# Altium project Smoke_Detector.PrjPcb (part 2 of 4)
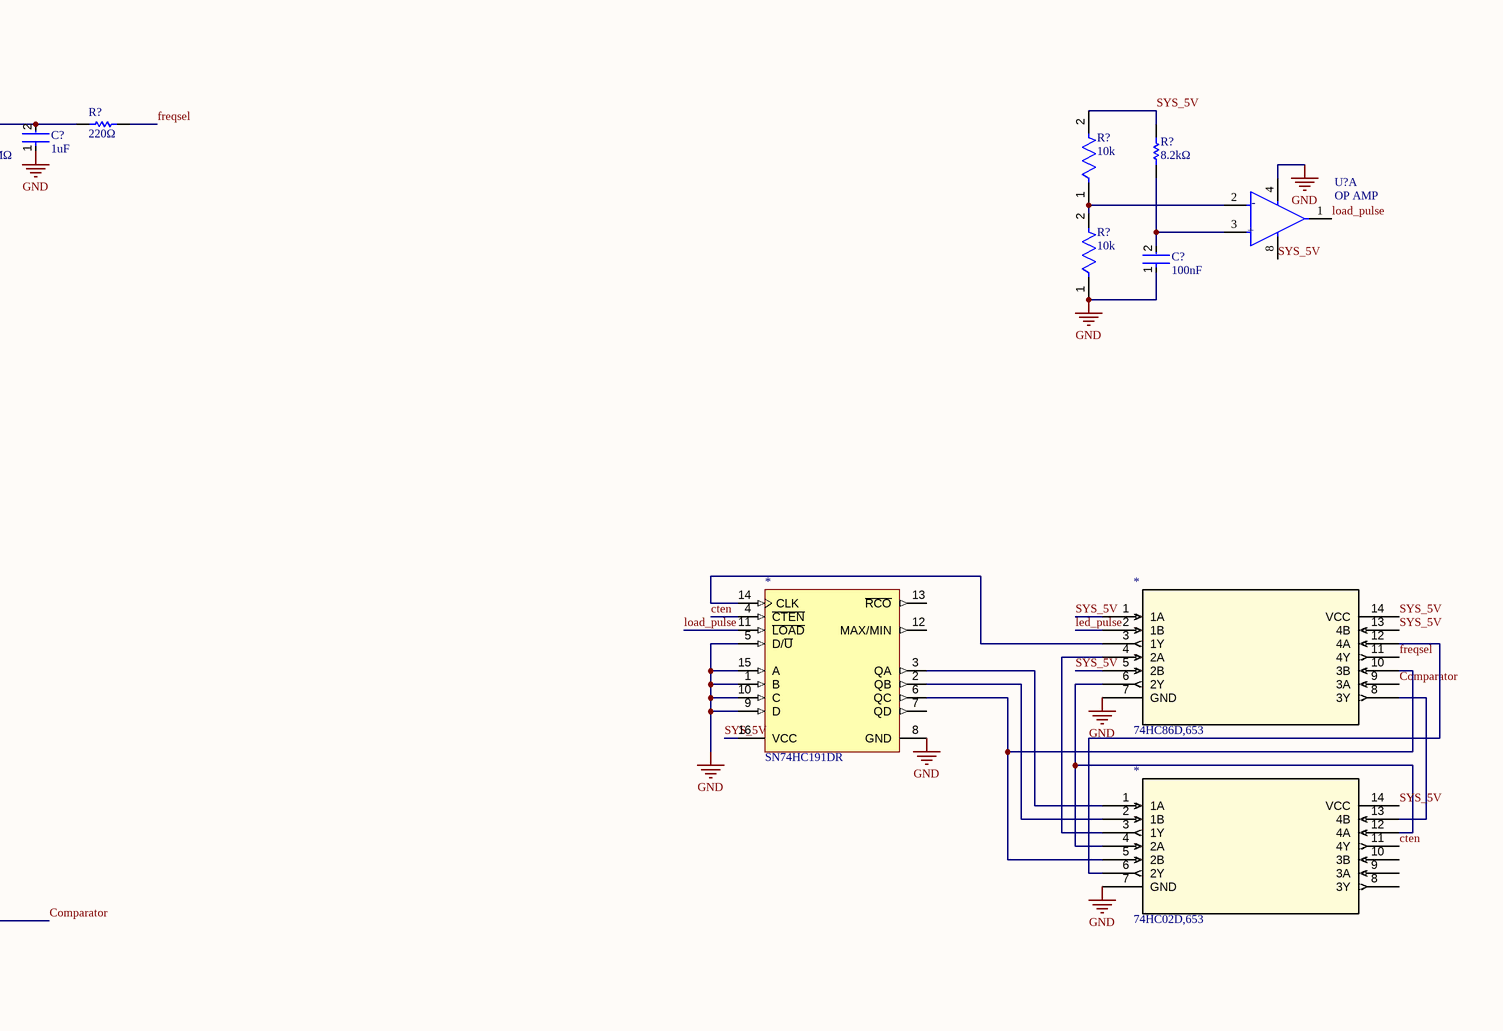
[diagram p2: Sheet1.SchDoc, right]

## Sheet Sheet1.SchDoc (continued)
### Library data of the parts
*#1 *#3 *#4 *#10 *#11 = AO3400A: MOSFET N-CH 30V 5.8A SOT-23; Manufacturer: Alpha & Omega Semiconductor; Continuous Drain Current (ID): 5.7A; Drain to Source Resistance: 26.5mΩ; Gate to Source Voltage (Vgs): 12V; Input Capacitance: 630pF; Max Junction Temperature (Tj): 150°C; Max Power Dissipation: 1.4W; Number of Channels: 1; Threshold Voltage: 650mV; Turn-Off Delay Time: 25ns; Turn-On Delay Time: 3ns; Supplier: DigiKey; Supplier Part Number: 785-1000-6-ND; Manufacturer Part Number: AO3400A; RoHS: Compliant; Category: MOSFETs; Stock: 336146; Pricing: 1=0.52, 10=0.322, 50=0.2332, 100=0.2043, 500=0.15316 (USD); Case/Package: SOT-23; Country of Origin: Mainland China; Drain to Source Breakdown Voltage: 30V; Drain to Source Voltage (Vdss): 30V; Export Control Classification Number (ECCN) Code: EAR99; Height: 1.25mm; Introduction Date: 2007-04-17; Lead Free: Lead Free; Lifecycle Status: Production; Max Operating Temperature: 150°C; Min Breakdown Voltage: 30V; Min Operating Temperature: -55°C; Mounting Technology: Surface Mount; Number of Elements: 1; Pins: 3; Number of Terminals: 3; Power Dissipation: 1.4W; Radiation Hardening: No; Rds On Max: 26.5mΩ; REACH SVHC: Unaffected; Schedule B: 8541290080, 8541290080|8541290080|8541290080|8541290080|8541290080; ComponentLink1URL: https://sigma.octopart.com:443/140150677/technical_drawing/Alpha-%26-Omega-Semiconductor-AO3400A.pdf?src-supplier=Alpha+%26+Omega+Semiconductor+SCT; ComponentLink1Description: https://sigma.octopart.com:443/140150677/technical_drawing/Alpha-%26-Omega-Semiconductor-AO3400A.pdf?src-supplier=Alpha+%26+Omega+Semiconductor+SCT; ComponentLink2URL: https://datasheet.octopart.com:443/AO3400A-Alpha-%26-Omega-Semiconductor-datasheet-11777925.pdf?src-supplier=IHS; ComponentLink2Description: https://datasheet.octopart.com:443/AO3400A-Alpha-%26-Omega-Semiconductor-datasheet-11777925.pdf?src-supplier=IHS; ComponentLink3URL: https://sigma.octopart.com:443/138895710/technical_drawing/Alpha-%26-Omega-Semiconductor-AO3400A.pdf?src-supplier=Upverter; ComponentLink3Description: https://sigma.octopart.com:443/138895710/technical_drawing/Alpha-%26-Omega-Semiconductor-AO3400A.pdf?src-supplier=Upverter; ComponentLink4URL: https://datasheet.octopart.com:443/AO3400A-Alpha-%26-Omega-Semiconductor-datasheet-14060799.pdf?src-supplier=iiiC; ComponentLink4Description: https://datasheet.octopart.com:443/AO3400A-Alpha-%26-Omega-Semiconductor-datasheet-14060799.pdf?src-supplier=iiiC; ComponentLink5URL: https://datasheet.octopart.com:443/AO3400A-Alpha-%26-Omega-Semiconductor-datasheet-5402508.pdf?src-supplier=Verical; ComponentLink5Description: https://datasheet.octopart.com:443/AO3400A-Alpha-%26-Omega-Semiconductor-datasheet-5402508.pdf?src-supplier=Verical
*#2 = TLC556IDR: 15V Dual LinCMOS timer 14-SOIC -40 to 85; Manufacturer: Texas Instruments; Manufacturer Lifecycle Status: ACTIVE; Frequency: 2.1MHz; High Level Output Current: -10mA; Low Level Output Current: 100mA; Max Power Dissipation: 950mW; Max Supply Voltage: 18V; Min Supply Voltage: 3V; Nominal Supply Current: 130µA; Number of Timers/Counters: 2; Operating Supply Current: 720µA; Supplier: Arrow Electronics; Supplier Part Number: TLC556IDR; Manufacturer Part Number: TLC556IDR; RoHS: Compliant; Category: Timers and Oscillators; Stock: 973; Pricing: 1=1.3938, 10=1.0552, 25=0.9641, 100=0.8647, 250=0.8042, 500=0.7847 (USD); Case/Package: SOIC; Contact Plating: Gold; Height: 0m; Lead Free: Lead Free; Length: 8.65mm; Lifecycle Status: Production; Max Operating Temperature: 85°C; Min Operating Temperature: -40°C; Mounting Technology: Surface Mount; Pins: 14; Power Dissipation: 950mW; Quiescent Current: 130µA; Radiation Hardening: No; Schedule B: 8542390000, 8542390000|8542390000, 8542390000|8542390000|8542390000, 8542390000|8542390000|8542390000|8542390000; Thickness: 1.58mm; Weight: 122.413241mg; Width: 3.91mm; ComponentLink1URL: https://sigma.octopart.com:443/182471030/technical_drawing/Texas-Instruments-TLC556IDR.pdf?src-supplier=Texas+Instruments; ComponentLink1Description: https://sigma.octopart.com:443/182471030/technical_drawing/Texas-Instruments-TLC556IDR.pdf?src-supplier=Texas+Instruments; ComponentLink2URL: https://octopart.com:443/opatz8j6/c1?t=wVb5vgt0zPQWKkF67eX7szHFu9eke679Os8KuuvsewqxubaA68h0RbxCTMV96P98jOA947BI5otjYLTO8NlJcm-sT0EwftDyiu21Zrbb2619OTaKXxEY5gqfTVo9yQc5eHmsnO_NjjO9pry39XW7zVwp5JZvYUuFi7CEvLfZBwXUvv5oJGvho0j5oLGTrHUekUSs9TZpc4u8Hs0dZvilMkIXoCg4ZsBkHlIICA4YDxdwRjADArPrk9usKJbDjqGpujKb6DUgPPp-5b6DXLWwp_NVSyXgaG7FrrCxwcsuC9e6EGdk3LvSbo4Poq0m1Apd1KwtZX406OXT8Kt7TXRfkPYmF30X_4theIHGy8QB6ScxhVB1SWES0wyhplT5iwiCIeo&src-supplier=Texas+Instruments; ComponentLink2Description: https://octopart.com:443/opatz8j6/c1?t=wVb5vgt0zPQWKkF67eX7szHFu9eke679Os8KuuvsewqxubaA68h0RbxCTMV96P98jOA947BI5otjYLTO8NlJcm-sT0EwftDyiu21Zrbb2619OTaKXxEY5gqfTVo9yQc5eHmsnO_NjjO9pry39XW7zVwp5JZvYUuFi7CEvLfZBwXUvv5oJGvho0j5oLGTrHUekUSs9TZpc4u8Hs0dZvilMkIXoCg4ZsBkHlIICA4YDxdwRjADArPrk9usKJbDjqGpujKb6DUgPPp-5b6DXLWwp_NVSyXgaG7FrrCxwcsuC9e6EGdk3LvSbo4Poq0m1Apd1KwtZX406OXT8Kt7TXRfkPYmF30X_4theIHGy8QB6ScxhVB1SWES0wyhplT5iwiCIeo&src-supplier=Texas+Instruments; ComponentLink3URL: https://datasheet.octopart.com:443/TLC556IDR-Texas-Instruments-datasheet-32026760.pdf?src-supplier=Texas+Instruments; ComponentLink3Description: https://datasheet.octopart.com:443/TLC556IDR-Texas-Instruments-datasheet-32026760.pdf?src-supplier=Texas+Instruments; ComponentLink4URL: https://datasheet.octopart.com:443/TLC556IDR-Texas-Instruments-datasheet-10255761.pdf?src-supplier=Texas+Instruments; ComponentLink4Description: https://datasheet.octopart.com:443/TLC556IDR-Texas-Instruments-datasheet-10255761.pdf?src-supplier=Texas+Instruments; ComponentLink5URL: https://sigma.octopart.com:443/49249646/technical_drawing/Texas-Instruments-TLC556IDR.pdf?src-supplier=Texas+Instruments; ComponentLink5Description: https://sigma.octopart.com:443/49249646/technical_drawing/Texas-Instruments-TLC556IDR.pdf?src-supplier=Texas+Instruments; ComponentLink6URL: https://datasheet.octopart.com:443/TLC556IDR-Texas-Instruments-datasheet-149920.pdf?src-supplier=Texas+Instruments; ComponentLink6Description: https://datasheet.octopart.com:443/TLC556IDR-Texas-Instruments-datasheet-149920.pdf?src-supplier=Texas+Instruments; ComponentLink7URL: https://datasheet.octopart.com:443/TLC556IDR-Texas-Instruments-datasheet-14363887.pdf?src-supplier=HQonline; ComponentLink7Description: https://datasheet.octopart.com:443/TLC556IDR-Texas-Instruments-datasheet-14363887.pdf?src-supplier=HQonline; ComponentLink8URL: https://datasheet.octopart.com:443/TLC556IDR-Texas-Instruments-datasheet-164411896.pdf?src-supplier=LCSC; ComponentLink8Description: https://datasheet.octopart.com:443/TLC556IDR-Texas-Instruments-datasheet-164411896.pdf?src-supplier=LCSC; ComponentLink9URL: https://datasheet.octopart.com:443/TLC556IDR-Texas-Instruments-datasheet-159117753.pdf?src-supplier=LCSC; ComponentLink9Description: https://datasheet.octopart.com:443/TLC556IDR-Texas-Instruments-datasheet-159117753.pdf?src-supplier=LCSC; ComponentLink10URL: https://datasheet.octopart.com:443/TLC556IDR-Texas-Instruments-datasheet-66581719.pdf?src-supplier=Newark; ComponentLink10Description: https://datasheet.octopart.com:443/TLC556IDR-Texas-Instruments-datasheet-66581719.pdf?src-supplier=Newark; ComponentLink11URL: https://datasheet.octopart.com:443/TLC556IDR-Texas-Instruments-datasheet-11637363.pdf?src-supplier=Arrow+Electronics; ComponentLink11Description: https://datasheet.octopart.com:443/TLC556IDR-Texas-Instruments-datasheet-11637363.pdf?src-supplier=Arrow+Electronics; ComponentLink12URL: https://datasheet.octopart.com:443/TLC556IDR-Texas-Instruments-datasheet-13614.pdf?src-supplier=DigiKey; ComponentLink12Description: https://datasheet.octopart.com:443/TLC556IDR-Texas-Instruments-datasheet-13614.pdf?src-supplier=DigiKey; ComponentLink13URL: http://sigma.octopart.com:80/reach_statement/Texas-Instruments-company-64.pdf?src-supplier=Compliance+Statements; ComponentLink13Description: http://sigma.octopart.com:80/reach_statement/Texas-Instruments-company-64.pdf?src-supplier=Compliance+Statements; ComponentLink14URL: http://sigma.octopart.com:80/conflict_mineral_statement/Texas-Instruments-company-63.pdf?src-supplier=Compliance+Statements; ComponentLink14Description: http://sigma.octopart.com:80/conflict_mineral_statement/Texas-Instruments-company-63.pdf?src-supplier=Compliance+Statements
*#5 = 74HC86D,653: 74HC Series 6 V Surface Mount Quad 2-Input EXCLUSIVE-OR Gate -SOIC-14; Manufacturer: Nexperia; Manufacturer Lifecycle Status: RELEASED FOR SUPPLY; High Level Output Current: -5.2mA; Load Capacitance: 50pF; Logic Function: OR, XOR; Low Level Output Current: 4mA; Max Supply Voltage: 6V; Min Supply Voltage: 2V; Nominal Supply Voltage (DC): 5V; Number of Circuits: 4; Number of Input Lines: 8; Number of Inputs: 2; Number of Outputs: 1; Output Current: 5.2mA; Propagation Delay: 36ns; Quiescent Current: 2µA; Schmitt Trigger Input: No; Supplier: Future Electronics; Supplier Part Number: 74HC86D,653; Manufacturer Part Number: 74HC86D,653; RoHS: Compliant; Category: Logic Gates; Stock: 27500; Pricing: 2500=0.116, 5000=0.115, 10000=0.113, 37500=0.11 (USD); Case/Package: SOP; China RoHS: Compliant; Contact Plating: Gold; Country of Origin: Mainland China, Thailand; Export Control Classification Number (ECCN) Code: EAR99; Height - Seated (Max): 1.75mm; Harmonized Tariff Schedule (HTS) Code: 8542.39.00.01; Introduction Date: 1990-12-01; Lead Free: Lead Free; Length: 8.65mm; Lifecycle Status: Production; Max Operating Temperature: 125°C; Min Operating Temperature: -40°C; Mounting Technology: Surface Mount; Number of Elements: 4; Number of Gates: 4; Number of Output Lines: 4; Pins: 14; Number of Terminals: 14; Operating Supply Voltage: 5V; Radiation Hardening: No; REACH SVHC: Unaffected; Schedule B: 8542390000, 8542390000|8542390000|8542390000|8542390000|8542390000; Temperature Grade: Automotive; Terminal Pitch: 1.27mm; Turn-On Delay Time: 36ns; Width: 3.9mm; ComponentLink1URL: https://datasheet.octopart.com:443/74HC86D%2C653-Nexperia-datasheet-87580431.pdf?src-supplier=Augswan; ComponentLink1Description: https://datasheet.octopart.com:443/74HC86D%2C653-Nexperia-datasheet-87580431.pdf?src-supplier=Augswan; ComponentLink2URL: https://datasheet.octopart.com:443/74HC86D%2C653-Nexperia-datasheet-61648451.pdf?src-supplier=IHS; ComponentLink2Description: https://datasheet.octopart.com:443/74HC86D%2C653-Nexperia-datasheet-61648451.pdf?src-supplier=IHS; ComponentLink3URL: https://datasheet.octopart.com:443/74HC86D%2C653-Nexperia-datasheet-140812836.pdf?src-supplier=IHS; ComponentLink3Description: https://datasheet.octopart.com:443/74HC86D%2C653-Nexperia-datasheet-140812836.pdf?src-supplier=IHS; ComponentLink4URL: https://datasheet.octopart.com:443/74HC86D%2C653-Philips-datasheet-12513527.pdf?src-supplier=element14+APAC; ComponentLink4Description: https://datasheet.octopart.com:443/74HC86D%2C653-Philips-datasheet-12513527.pdf?src-supplier=element14+APAC; ComponentLink5URL: https://datasheet.octopart.com:443/74HC86D%2C653-NXP-datasheet-19589.pdf?src-supplier=Arrow+Electronics; ComponentLink5Description: https://datasheet.octopart.com:443/74HC86D%2C653-NXP-datasheet-19589.pdf?src-supplier=Arrow+Electronics; ComponentLink6URL: https://datasheet.octopart.com:443/74HC86D%2C653-Nexperia-datasheet-160667643.pdf?src-supplier=SHENGYU+ELECTRONICS; ComponentLink6Description: https://datasheet.octopart.com:443/74HC86D%2C653-Nexperia-datasheet-160667643.pdf?src-supplier=SHENGYU+ELECTRONICS; ComponentLink7URL: https://datasheet.octopart.com:443/74HC86D%2C653-NXP-Semiconductors-datasheet-17720673.pdf?src-supplier=Jameco+(USA); ComponentLink7Description: https://datasheet.octopart.com:443/74HC86D%2C653-NXP-Semiconductors-datasheet-17720673.pdf?src-supplier=Jameco+(USA); ComponentLink8URL: http://sigma.octopart.com:80/reach_statement/NXP-Semiconductors-company-13.pdf?src-supplier=Compliance+Statements; ComponentLink8Description: http://sigma.octopart.com:80/reach_statement/NXP-Semiconductors-company-13.pdf?src-supplier=Compliance+Statements; ComponentLink9URL: http://sigma.octopart.com:80/rohs_statement/NXP-Semiconductors-company-12.pdf?src-supplier=Compliance+Statements; ComponentLink9Description: http://sigma.octopart.com:80/rohs_statement/NXP-Semiconductors-company-12.pdf?src-supplier=Compliance+Statements
*#6 = SN74HC191DR: Counter Single 4-Bit Async Binary Up/Down 16-Pin SOIC T/R; Manufacturer: Texas Instruments; Manufacturer Lifecycle Status: ACTIVE; Clock Edge Trigger Type: Positive Edge; Direction: Bidirectional; Frequency: 48MHz; Max Supply Voltage: 6V; Min Supply Voltage: 2V; Number of Bits: 4; Number of Elements: 1; Operating Supply Voltage: 5V; Propagation Delay: 330ns; Sync/Async: Synchronous; Supplier: Arrow Electronics; Supplier Part Number: SN74HC191DR; Manufacturer Part Number: SN74HC191DR; RoHS: Compliant; Category: Counters; Stock: 558; Pricing: 1=0.3109, 10=0.3077, 25=0.3045, 100=0.3012, 250=0.298, 500=0.2948 (USD); Case/Package: SOIC; Height: 1.75mm; Lead Free: Lead Free; Length: 9.9mm; Lifecycle Status: Production; Logic Function: Counter; Max Operating Temperature: 85°C; Min Operating Temperature: -40°C; Mounting Technology: Surface Mount; Number of Bits per Element: 4; Pins: 16; Radiation Hardening: No; Schedule B: 8542390000, 8542390000|8542390000|8542390000|8542390000|8542390000; Thickness: 1.58mm; Turn-On Delay Time: 330ns; Weight: 141.690917mg; Width: 3.91mm; ComponentLink1URL: https://datasheet.octopart.com:443/SN74HC191DR-Texas-Instruments-datasheet-33033771.pdf?src-supplier=Texas+Instruments; ComponentLink1Description: https://datasheet.octopart.com:443/SN74HC191DR-Texas-Instruments-datasheet-33033771.pdf?src-supplier=Texas+Instruments; ComponentLink2URL: https://octopart.com:443/opatz8j6/c1?t=livQ8q43hWssvsTbIukJTl-bIiZFqHZ0_eG3ZISHFBGsaXj-6bBEoDG3PlwY2extO-X4vpm_CU7QLECDmgYzLGckRBw-Kbj8krgv4rmDK5yCwmDJ3CNVrP-qwPYpI0C_npVjETDCSzGdwJl8AedVD4--R_M23QxTnmHvlW1ezJkcgh_L1X-WuZU7RjpO56SQ3Zy_2CfdvVUvgApZvWencagwVo7xUZlWYvKblZWRwPqoRaIW_0nKcn1YlJgtddRiOWr6k4nRbeS5A28F22AkvDGS5XTih2WxDgVJofo11MXYRBHOIIfl1zg_UGo2ZSsVug4JVBZftDOiZiHXpjFkYXXcMh70ddjpxIu2AbTHTmViyoSqUNmmygbjeYWlvFqXFwPzDA&src-supplier=Texas+Instruments; ComponentLink2Description: https://octopart.com:443/opatz8j6/c1?t=livQ8q43hWssvsTbIukJTl-bIiZFqHZ0_eG3ZISHFBGsaXj-6bBEoDG3PlwY2extO-X4vpm_CU7QLECDmgYzLGckRBw-Kbj8krgv4rmDK5yCwmDJ3CNVrP-qwPYpI0C_npVjETDCSzGdwJl8AedVD4--R_M23QxTnmHvlW1ezJkcgh_L1X-WuZU7RjpO56SQ3Zy_2CfdvVUvgApZvWencagwVo7xUZlWYvKblZWRwPqoRaIW_0nKcn1YlJgtddRiOWr6k4nRbeS5A28F22AkvDGS5XTih2WxDgVJofo11MXYRBHOIIfl1zg_UGo2ZSsVug4JVBZftDOiZiHXpjFkYXXcMh70ddjpxIu2AbTHTmViyoSqUNmmygbjeYWlvFqXFwPzDA&src-supplier=Texas+Instruments; ComponentLink3URL: https://datasheet.octopart.com:443/SN74HC191DR-Texas-Instruments-datasheet-10254193.pdf?src-supplier=Texas+Instruments; ComponentLink3Description: https://datasheet.octopart.com:443/SN74HC191DR-Texas-Instruments-datasheet-10254193.pdf?src-supplier=Texas+Instruments; ComponentLink4URL: https://sigma.octopart.com:443/49249801/technical_drawing/Texas-Instruments-SN74HC191DR.pdf?src-supplier=Texas+Instruments; ComponentLink4Description: https://sigma.octopart.com:443/49249801/technical_drawing/Texas-Instruments-SN74HC191DR.pdf?src-supplier=Texas+Instruments; ComponentLink5URL: https://datasheet.octopart.com:443/SN74HC191DR-Texas-Instruments-datasheet-10253684.pdf?src-supplier=Texas+Instruments; ComponentLink5Description: https://datasheet.octopart.com:443/SN74HC191DR-Texas-Instruments-datasheet-10253684.pdf?src-supplier=Texas+Instruments; ComponentLink6URL: https://datasheet.octopart.com:443/SN74HC191DR-Texas-Instruments-datasheet-149727.pdf?src-supplier=Mouser; ComponentLink6Description: https://datasheet.octopart.com:443/SN74HC191DR-Texas-Instruments-datasheet-149727.pdf?src-supplier=Mouser; ComponentLink7URL: https://datasheet.octopart.com:443/SN74HC191DR-Texas-Instruments-datasheet-11538999.pdf?src-supplier=HQonline; ComponentLink7Description: https://datasheet.octopart.com:443/SN74HC191DR-Texas-Instruments-datasheet-11538999.pdf?src-supplier=HQonline; ComponentLink8URL: https://datasheet.octopart.com:443/SN74HC191DR-Texas-Instruments-datasheet-165804434.pdf?src-supplier=LCSC; ComponentLink8Description: https://datasheet.octopart.com:443/SN74HC191DR-Texas-Instruments-datasheet-165804434.pdf?src-supplier=LCSC; ComponentLink9URL: https://datasheet.octopart.com:443/SN74HC191DR-Texas-Instruments-datasheet-159116066.pdf?src-supplier=LCSC; ComponentLink9Description: https://datasheet.octopart.com:443/SN74HC191DR-Texas-Instruments-datasheet-159116066.pdf?src-supplier=LCSC; ComponentLink10URL: https://datasheet.octopart.com:443/SN74HC191DR-Texas-Instruments-datasheet-164417292.pdf?src-supplier=SHENGYU+ELECTRONICS; ComponentLink10Description: https://datasheet.octopart.com:443/SN74HC191DR-Texas-Instruments-datasheet-164417292.pdf?src-supplier=SHENGYU+ELECTRONICS; ComponentLink11URL: https://datasheet.octopart.com:443/SN74HC191DR-Texas-Instruments-datasheet-125515.pdf?src-supplier=DigiKey; ComponentLink11Description: https://datasheet.octopart.com:443/SN74HC191DR-Texas-Instruments-datasheet-125515.pdf?src-supplier=DigiKey; ComponentLink12URL: http://sigma.octopart.com:80/reach_statement/Texas-Instruments-company-64.pdf?src-supplier=Compliance+Statements; ComponentLink12Description: http://sigma.octopart.com:80/reach_statement/Texas-Instruments-company-64.pdf?src-supplier=Compliance+Statements; ComponentLink13URL: http://sigma.octopart.com:80/conflict_mineral_statement/Texas-Instruments-company-63.pdf?src-supplier=Compliance+Statements; ComponentLink13Description: http://sigma.octopart.com:80/conflict_mineral_statement/Texas-Instruments-company-63.pdf?src-supplier=Compliance+Statements
*#7 = PVG3A103C01R00: Cermet trimmer potentiometer, 10 kΩ, 0.25 W, SMD, on top, PVG3A103C01R00; Manufacturer: Bourns; Max Power Dissipation: 250mW; Number of Turns: 1; Value: 10kΩ; Temperature Coefficient: 150ppm/°C; Tolerance: 20%; Supplier: Avnet; Supplier Part Number: PVG3A103C01R00; Manufacturer Part Number: PVG3A103C01R00; RoHS: Compliant; Category: Variable Resistors and Potentiometers; Stock: 1000; Pricing: 1=1.05, 25=0.811, 100=0.725, 250=0.673, 500=0.637, 1000=0.624, 5000=0.612 (USD); Composition: Cermet; Country of Origin: Taiwan; Export Control Classification Number (ECCN) Code: EAR99; Height: 2mm; Harmonized Tariff Schedule (HTS) Code: 8533.40.80.50; Introduction Date: 2018-10-26; Length: 3.6mm; Lifecycle Status: Production; Max Operating Temperature: 125°C; Min Operating Temperature: -55°C; Mounting Technology: Surface Mount; Number of Terminals: 3; Power Rating: 250mW; REACH SVHC: Unaffected; Schedule B: 8533400080, 8533400080|8533400080|8533400080|8533400080|8533400080; Width: 3.4mm; ComponentLink1URL: https://datasheet.octopart.com:443/PVG3A103C01R00-Bourns-datasheet-182141984.pdf?src-supplier=IHS; ComponentLink1Description: https://datasheet.octopart.com:443/PVG3A103C01R00-Bourns-datasheet-182141984.pdf?src-supplier=IHS; ComponentLink2URL: https://datasheet.octopart.com:443/PVG3A103C01R00-Bourns-datasheet-154729832.pdf?src-supplier=Farnell; ComponentLink2Description: https://datasheet.octopart.com:443/PVG3A103C01R00-Bourns-datasheet-154729832.pdf?src-supplier=Farnell; ComponentLink3URL: https://datasheet.octopart.com:443/PVG3A103C01R00-Bourns-datasheet-82548162.pdf?src-supplier=element14+APAC; ComponentLink3Description: https://datasheet.octopart.com:443/PVG3A103C01R00-Bourns-datasheet-82548162.pdf?src-supplier=element14+APAC; ComponentLink4URL: https://datasheet.octopart.com:443/PVG3A103C01R00-Bourns-datasheet-177040425.pdf?src-supplier=Burklin+Elektronik; ComponentLink4Description: https://datasheet.octopart.com:443/PVG3A103C01R00-Bourns-datasheet-177040425.pdf?src-supplier=Burklin+Elektronik; ComponentLink5URL: https://datasheet.octopart.com:443/PVG3A103C01R00-Bourns-datasheet-165058415.pdf?src-supplier=Burklin+Elektronik; ComponentLink5Description: https://datasheet.octopart.com:443/PVG3A103C01R00-Bourns-datasheet-165058415.pdf?src-supplier=Burklin+Elektronik; ComponentLink6URL: https://datasheet.octopart.com:443/PVG3A103C01R00-Bourns-datasheet-159777439.pdf?src-supplier=RS+(Formerly+Allied+Electronics); ComponentLink6Description: https://datasheet.octopart.com:443/PVG3A103C01R00-Bourns-datasheet-159777439.pdf?src-supplier=RS+(Formerly+Allied+Electronics); ComponentLink7URL: http://sigma.octopart.com:80/conflict_mineral_statement/Bourns-company-36.pdf?src-supplier=Compliance+Statements; ComponentLink7Description: http://sigma.octopart.com:80/conflict_mineral_statement/Bourns-company-36.pdf?src-supplier=Compliance+Statements
*#8 = 74HC02D,653: 74HC Series 6V High Speed Si-Gate CMOS Quad 2-Input NOR Gate - SOIC-14; Manufacturer: Nexperia; Manufacturer Lifecycle Status: RELEASED FOR SUPPLY; High Level Output Current: -5.2mA; Load Capacitance: 50pF; Low Level Output Current: 4mA; Max Supply Current: 40µA; Min Supply Voltage: 2V; Nominal Supply Voltage (DC): 5V; Number of Channels: 4; Number of Input Lines: 2; Number of Output Lines: 1; Output Current: 5.2mA; Propagation Delay: 27ns; Quiescent Current: 2µA; Schmitt Trigger Input: No; Turn-On Delay Time: 7ns; Supplier: Future Electronics; Supplier Part Number: 74HC02D,653; Manufacturer Part Number: 74HC02D,653; RoHS: Compliant; Category: Logic Gates; Stock: 87500; Pricing: 2500=0.109, 5000=0.107, 10000=0.106, 37500=0.103 (USD); Case/Package: SOP; China RoHS: Compliant; Contact Plating: Gold; Country of Origin: Mainland China, Thailand; Export Control Classification Number (ECCN) Code: EAR99; Height - Seated (Max): 1.75mm; Harmonized Tariff Schedule (HTS) Code: 8542.39.00.01; Introduction Date: 1990-12-01; Lead Free: Lead Free; Length: 8.65mm; Lifecycle Status: Production; Logic Function: NOR; Max Operating Temperature: 125°C; Max Supply Voltage: 6V; Min Operating Temperature: -40°C; Mounting Technology: Surface Mount; Number of Circuits: 4; Number of Elements: 4; Number of Gates: 4; Number of Inputs: 2; Pins: 14; Number of Terminals: 14; Operating Supply Voltage: 5V; Radiation Hardening: No; REACH SVHC: Unaffected; Schedule B: 8542390000, 8542390000|8542390000|8542390000|8542390000|8542390000; Temperature Grade: Automotive; Terminal Pitch: 1.27mm; Voltage: 5V; Width: 3.9mm; ComponentLink1URL: https://datasheet.octopart.com:443/74HC02D%2C653-Nexperia-datasheet-87580166.pdf?src-supplier=IHS; ComponentLink1Description: https://datasheet.octopart.com:443/74HC02D%2C653-Nexperia-datasheet-87580166.pdf?src-supplier=IHS; ComponentLink2URL: https://datasheet.octopart.com:443/74HC02D%2C653-Nexperia-datasheet-59327597.pdf?src-supplier=Newark; ComponentLink2Description: https://datasheet.octopart.com:443/74HC02D%2C653-Nexperia-datasheet-59327597.pdf?src-supplier=Newark; ComponentLink3URL: https://datasheet.octopart.com:443/74HC02D%2C653-Nexperia-datasheet-11978307.pdf?src-supplier=element14+APAC; ComponentLink3Description: https://datasheet.octopart.com:443/74HC02D%2C653-Nexperia-datasheet-11978307.pdf?src-supplier=element14+APAC; ComponentLink4URL: https://datasheet.octopart.com:443/74HC02D%2C653-Nexperia-datasheet-5318266.pdf?src-supplier=Factory+Futures; ComponentLink4Description: https://datasheet.octopart.com:443/74HC02D%2C653-Nexperia-datasheet-5318266.pdf?src-supplier=Factory+Futures; ComponentLink5URL: https://datasheet.octopart.com:443/74HC02D%2C653-Nexperia-datasheet-160667651.pdf?src-supplier=Augswan; ComponentLink5Description: https://datasheet.octopart.com:443/74HC02D%2C653-Nexperia-datasheet-160667651.pdf?src-supplier=Augswan; ComponentLink6URL: https://datasheet.octopart.com:443/74HC02D%2C653-Nexperia-datasheet-180922420.pdf?src-supplier=TME; ComponentLink6Description: https://datasheet.octopart.com:443/74HC02D%2C653-Nexperia-datasheet-180922420.pdf?src-supplier=TME; ComponentLink7URL: http://sigma.octopart.com:80/reach_statement/NXP-Semiconductors-company-13.pdf?src-supplier=Compliance+Statements; ComponentLink7Description: http://sigma.octopart.com:80/reach_statement/NXP-Semiconductors-company-13.pdf?src-supplier=Compliance+Statements; ComponentLink8URL: http://sigma.octopart.com:80/rohs_statement/NXP-Semiconductors-company-12.pdf?src-supplier=Compliance+Statements; ComponentLink8Description: http://sigma.octopart.com:80/rohs_statement/NXP-Semiconductors-company-12.pdf?src-supplier=Compliance+Statements
*#9 *?#1 *?#2 = TSAL6200: Infrared (IR) Emitter 940nm 1.35V 100mA 40mW/sr @ 100mA 34° Radial, 5mm Dia (T 1 3/4); Manufacturer: Vishay; Fall Time: 800ns; Lead Length: 25.7mm; Lens Style: Circular, Colored, Round; Max Power Dissipation: 160mW; Number of Circuits: 1; Operating Supply Voltage: 1.6V; Output Power: 35mW; Power Rating: 210mW; Reverse Voltage: 5V; Shape: Round; Viewing Angle: 17°; Supplier: Avnet; Supplier Part Number: TSAL6200; Manufacturer Part Number: TSAL6200; RoHS: Compliant; Category: LEDs; Stock: 5493; Pricing: 1=0.513, 10=0.361, 100=0.265, 500=0.222, 1000=0.208, 2500=0.202, 10000=0.176 (USD); Case/Package: Radial; Contact Plating: Tin; Country of Origin: Mainland China; Depth: 5.8mm; Forward Current: 100mA; Forward Voltage: 1.35V; Harmonized Tariff Schedule (HTS) Code: 8541.40.20.00; Introduction Date: 1998-02-03; Lead Free: Lead Free; Length: 5.8mm; Lifecycle Status: Production; Max Operating Temperature: 85°C; Min Operating Temperature: -55°C; Mounting Technology: Through Hole; Number of Elements: 1; Number of LEDs: 1; Pins: 2; Orientation: Top View; Packaging: Bulk; Peak Wavelength: 940nm; Radiation Hardening: No; REACH SVHC: Unaffected; Rise Time: 800ns; Schedule B: 8541402000, 8541402000|8541402000, 8541402000|8541402000|8541402000, 8541402000|8541402000|8541402000|8541402000; Test Current: 100mA; Voltage Rating (DC): 5V; Wavelength: 940nm; ComponentLink1URL: https://datasheet.octopart.com:443/TSAL6200-Vishay-datasheet-181476199.pdf?src-supplier=IHS; ComponentLink1Description: https://datasheet.octopart.com:443/TSAL6200-Vishay-datasheet-181476199.pdf?src-supplier=IHS; ComponentLink2URL: https://datasheet.octopart.com:443/TSAL6200-Vishay-datasheet-181483901.pdf?src-supplier=IHS; ComponentLink2Description: https://datasheet.octopart.com:443/TSAL6200-Vishay-datasheet-181483901.pdf?src-supplier=IHS; ComponentLink3URL: https://datasheet.octopart.com:443/TSAL6200-Vishay-datasheet-141913874.pdf?src-supplier=Upverter; ComponentLink3Description: https://datasheet.octopart.com:443/TSAL6200-Vishay-datasheet-141913874.pdf?src-supplier=Upverter; ComponentLink4URL: https://datasheet.octopart.com:443/TSAL6200-Vishay-datasheet-8558926.pdf?src-supplier=Newark; ComponentLink4Description: https://datasheet.octopart.com:443/TSAL6200-Vishay-datasheet-8558926.pdf?src-supplier=Newark; ComponentLink5URL: https://datasheet.octopart.com:443/TSAL6200-Vishay-datasheet-506685.pdf?src-supplier=Newark; ComponentLink5Description: https://datasheet.octopart.com:443/TSAL6200-Vishay-datasheet-506685.pdf?src-supplier=Newark; ComponentLink6URL: https://datasheet.octopart.com:443/TSAL6200-Vishay-datasheet-34170271.pdf?src-supplier=Newark; ComponentLink6Description: https://datasheet.octopart.com:443/TSAL6200-Vishay-datasheet-34170271.pdf?src-supplier=Newark; ComponentLink7URL: https://datasheet.octopart.com:443/TSAL6200-Vishay-Semiconductor-datasheet-33014447.pdf?src-supplier=Newark; ComponentLink7Description: https://datasheet.octopart.com:443/TSAL6200-Vishay-Semiconductor-datasheet-33014447.pdf?src-supplier=Newark; ComponentLink8URL: https://datasheet.octopart.com:443/TSAL6200...-Vishay-datasheet-78835386.pdf?src-supplier=element14+APAC; ComponentLink8Description: https://datasheet.octopart.com:443/TSAL6200...-Vishay-datasheet-78835386.pdf?src-supplier=element14+APAC; ComponentLink9URL: https://datasheet.octopart.com:443/TSAL6200-Vishay-datasheet-62319407.pdf?src-supplier=Farnell; ComponentLink9Description: https://datasheet.octopart.com:443/TSAL6200-Vishay-datasheet-62319407.pdf?src-supplier=Farnell; ComponentLink10URL: https://datasheet.octopart.com:443/TSAL6200-Vishay-datasheet-34180579.pdf?src-supplier=Farnell; ComponentLink10Description: https://datasheet.octopart.com:443/TSAL6200-Vishay-datasheet-34180579.pdf?src-supplier=Farnell; ComponentLink11URL: https://datasheet.octopart.com:443/TSAL6200.-Vishay-datasheet-508933.pdf?src-supplier=Farnell; ComponentLink11Description: https://datasheet.octopart.com:443/TSAL6200.-Vishay-datasheet-508933.pdf?src-supplier=Farnell; ComponentLink12URL: https://datasheet.octopart.com:443/TSAL6200-Vishay-datasheet-68150.pdf?src-supplier=TME; ComponentLink12Description: https://datasheet.octopart.com:443/TSAL6200-Vishay-datasheet-68150.pdf?src-supplier=TME; ComponentLink13URL: https://datasheet.octopart.com:443/TSAL6200-Vishay-datasheet-41222433.pdf?src-supplier=Seeed+Studio; ComponentLink13Description: https://datasheet.octopart.com:443/TSAL6200-Vishay-datasheet-41222433.pdf?src-supplier=Seeed+Studio; ComponentLink14URL: https://datasheet.octopart.com:443/TSAL6200-Vishay-datasheet-14190171.pdf?src-supplier=iiiC; ComponentLink14Description: https://datasheet.octopart.com:443/TSAL6200-Vishay-datasheet-14190171.pdf?src-supplier=iiiC; ComponentLink15URL: https://datasheet.octopart.com:443/TSAL6200-Vishay-datasheet-10862748.pdf?src-supplier=RS+(Formerly+Allied+Electronics); ComponentLink15Description: https://datasheet.octopart.com:443/TSAL6200-Vishay-datasheet-10862748.pdf?src-supplier=RS+(Formerly+Allied+Electronics); ComponentLink16URL: http://sigma.octopart.com:80/rohs_statement/Vishay-company-15.pdf?src-supplier=Compliance+Statements; ComponentLink16Description: http://sigma.octopart.com:80/rohs_statement/Vishay-company-15.pdf?src-supplier=Compliance+Statements
C?#1 C?#6 = CL21B105KBFNNNE: CAP CER 1uF 50V X7R 0805; Manufacturer: Samsung Electro-Mechanics; Value: 1µF; Dielectric Material: Ceramic; Tolerance: 10%; Supplier: Avnet; Supplier Part Number: CL21B105KBFNNNE; Manufacturer Part Number: CL21B105KBFNNNE; RoHS: Compliant; Category: Ceramic Capacitors; Pricing: 2000=0.01628 (USD); Case/Package: 0805; Case Code (Imperial): 0805; Case Code (Metric): 2012; China RoHS: Compliant; Country of Origin: Mainland China, Philippines, South Korea; Depth: 1.25mm; Dielectric: X7R; Export Control Classification Number (ECCN) Code: EAR99; Height: 1.35mm; Harmonized Tariff Schedule (HTS) Code: 8532.24.00.20; Introduction Date: 2010-07-30; Length: 2mm; Lifecycle Status: Production; Material: Ceramic; Max Operating Temperature: 125°C; Min Operating Temperature: -55°C; Mounting Technology: Surface Mount; Number of Terminals: 2; Radiation Hardening: No; REACH SVHC: Unaffected; Schedule B: 8532240020, 8532240020|8532240020, 8532240020|8532240020|8532240020, 8532240020|8532240020|8532240020|8532240020; Thickness: 1.3462mm; Voltage: 50V; Voltage Rating: 50V; Voltage Rating (DC): 50V; Width: 1.25mm; ComponentLink1URL: https://datasheet.octopart.com:443/CL21B105KBFNNNE-Samsung-Electro-Mechanics-datasheet-136482495.pdf?src-supplier=IHS; ComponentLink1Description: https://datasheet.octopart.com:443/CL21B105KBFNNNE-Samsung-Electro-Mechanics-datasheet-136482495.pdf?src-supplier=IHS; ComponentLink2URL: https://datasheet.octopart.com:443/CL21B105KBFNNNE-Samsung-Electro-Mechanics-datasheet-11733377.pdf?src-supplier=Future+Electronics; ComponentLink2Description: https://datasheet.octopart.com:443/CL21B105KBFNNNE-Samsung-Electro-Mechanics-datasheet-11733377.pdf?src-supplier=Future+Electronics; ComponentLink3URL: https://datasheet.octopart.com:443/CL21B105KBFNNNE-Samsung-Electro-Mechanics-datasheet-116891038.pdf?src-supplier=Future+Electronics; ComponentLink3Description: https://datasheet.octopart.com:443/CL21B105KBFNNNE-Samsung-Electro-Mechanics-datasheet-116891038.pdf?src-supplier=Future+Electronics; ComponentLink4URL: https://datasheet.octopart.com:443/CL21B105KBFNNNE-Samsung-Electro-Mechanics-datasheet-81462183.pdf?src-supplier=Future+Electronics; ComponentLink4Description: https://datasheet.octopart.com:443/CL21B105KBFNNNE-Samsung-Electro-Mechanics-datasheet-81462183.pdf?src-supplier=Future+Electronics; ComponentLink5URL: https://datasheet.octopart.com:443/CL21B105KBFNNNE-Samsung-datasheet-48647582.pdf?src-supplier=Future+Electronics; ComponentLink5Description: https://datasheet.octopart.com:443/CL21B105KBFNNNE-Samsung-datasheet-48647582.pdf?src-supplier=Future+Electronics; ComponentLink6URL: https://datasheet.octopart.com:443/CL21B105KBFNNNE-Samsung-datasheet-8326294.pdf?src-supplier=Future+Electronics; ComponentLink6Description: https://datasheet.octopart.com:443/CL21B105KBFNNNE-Samsung-datasheet-8326294.pdf?src-supplier=Future+Electronics; ComponentLink7URL: https://datasheet.octopart.com:443/CL21B105KBFNNNE-Samsung-Electro-Mechanics-datasheet-149045959.pdf?src-supplier=Future+Electronics; ComponentLink7Description: https://datasheet.octopart.com:443/CL21B105KBFNNNE-Samsung-Electro-Mechanics-datasheet-149045959.pdf?src-supplier=Future+Electronics; ComponentLink8URL: https://datasheet.octopart.com/CL21B105KBFNNNE-Samsung-Electro-Mechanics-datasheet-97040617.pdf; ComponentLink8Description: https://datasheet.octopart.com/CL21B105KBFNNNE-Samsung-Electro-Mechanics-datasheet-97040617.pdf; ComponentLink9URL: https://datasheet.octopart.com/CL21B105KBFNNNE-Samsung-Electro-Mechanics-datasheet-8324245.pdf; ComponentLink9Description: https://datasheet.octopart.com/CL21B105KBFNNNE-Samsung-Electro-Mechanics-datasheet-8324245.pdf; ComponentLink10URL: https://datasheet.octopart.com/General-Multilayer-Ceramic-Capacitors-Samsung-datasheet-family-111.pdf; ComponentLink10Description: https://datasheet.octopart.com/General-Multilayer-Ceramic-Capacitors-Samsung-datasheet-family-111.pdf; ComponentLink11URL: https://datasheet.octopart.com:443/CL21B105KBFNNNE-Samsung-datasheet-59220082.pdf?src-supplier=TME; ComponentLink11Description: https://datasheet.octopart.com:443/CL21B105KBFNNNE-Samsung-datasheet-59220082.pdf?src-supplier=TME; ComponentLink12URL: http://sigma.octopart.com:80/rohs_certificate/General-Multilayer-Ceramic-Capacitors-Samsung-family-110.pdf?src-supplier=Compliance+Statements; ComponentLink12Description: http://sigma.octopart.com:80/rohs_certificate/General-Multilayer-Ceramic-Capacitors-Samsung-family-110.pdf?src-supplier=Compliance+Statements; ComponentLink13URL: http://sigma.octopart.com:80/rohs_statement/General-Multilayer-Ceramic-Capacitors-Samsung-family-132.pdf?src-supplier=Compliance+Statements; ComponentLink13Description: http://sigma.octopart.com:80/rohs_statement/General-Multilayer-Ceramic-Capacitors-Samsung-family-132.pdf?src-supplier=Compliance+Statements; ComponentLink14URL: http://sigma.octopart.com:80/reach_statement/General-Multilayer-Ceramic-Capacitors-Samsung-family-133.pdf?src-supplier=Compliance+Statements; ComponentLink14Description: http://sigma.octopart.com:80/reach_statement/General-Multilayer-Ceramic-Capacitors-Samsung-family-133.pdf?src-supplier=Compliance+Statements
C?#2 C?#3 C?#5 C?#7-C?#9 C?#11-C?#13 C?#16 = CC0805KRX7R9BB104: CAP CER 100nF 50V X7R 0805; Manufacturer: Yageo Group; Manufacturer Package Identifier: CC0805-0.85; Dielectric Material: Ceramic; Insulation Resistance: 100GΩ; Tolerance: 10%; Supplier: Future Electronics; Supplier Part Number: CC0805KRX7R9BB104; Manufacturer Part Number: CC0805KRX7R9BB104; RoHS: Compliant; Category: Ceramic Capacitors; Stock: 10784000; Pricing: 4000=0.0847, 8000=0.0834, 12000=0.0826, 20000=0.0816, 40000=0.0794 (USD); Value: 100nF; Case/Package: 0805; Case Code (Imperial): 0805; Case Code (Metric): 2012; China RoHS: Compliant; Country of Origin: Mainland China, Taiwan; Depth: 1.25mm; Dielectric: X7R; Export Control Classification Number (ECCN) Code: EAR99; Halogen Free: Halogen Free; Height: 850µm; Harmonized Tariff Schedule (HTS) Code: 8532.24.00.20; Introduction Date: 2003-01-27; Lead Free: Lead Free; Length: 2mm; Lifecycle Status: Production; Material: Ceramic; Max Operating Temperature: 125°C; Min Operating Temperature: -55°C; Mounting Technology: Surface Mount; Pins: 2; Number of Terminals: 2; Packaging: Cut Tape; Radiation Hardening: No; REACH SVHC: Unaffected; Schedule B: 8532240020, 8532240020|8532240020|8532240020|8532240020|8532240020|8532240020|8532240020|8532240020|8532240020|8532240020|8532240020|8532240020|8532240020|8532240020|8532240020|8532240020, 8532240020|8532240020|8532240020|8532240020|8532240020|8532240020|8532240020|8532240020|8532240020|8532240020|8532240020|8532240020|8532240020|8532240020|8532240020|8532240020|8532240020, 8532240020|8532240020|8532240020|8532240020|8532240020|8532240020|8532240020|8532240020|8532240020|8532240020|8532240020|8532240020|8532240020|8532240020|8532240020|8532240020|8532240020|8532240020; Termination: SMD/SMT; Thickness: 838.2µm; Voltage: 50V; Voltage Rating: 50V; Voltage Rating (DC): 50V; Width: 1.25mm; ComponentLink1URL: https://datasheet.octopart.com:443/CC0805KRX7R9BB104-Yageo-datasheet-177165144.pdf?src-supplier=IHS; ComponentLink1Description: https://datasheet.octopart.com:443/CC0805KRX7R9BB104-Yageo-datasheet-177165144.pdf?src-supplier=IHS; ComponentLink2URL: https://datasheet.octopart.com:443/CC0805KRX7R9BB104-Yageo-datasheet-78855689.pdf?src-supplier=Upverter; ComponentLink2Description: https://datasheet.octopart.com:443/CC0805KRX7R9BB104-Yageo-datasheet-78855689.pdf?src-supplier=Upverter; ComponentLink3URL: https://datasheet.octopart.com:443/CC0805KRX7R9BB104-Yageo-datasheet-68298032.pdf?src-supplier=Upverter; ComponentLink3Description: https://datasheet.octopart.com:443/CC0805KRX7R9BB104-Yageo-datasheet-68298032.pdf?src-supplier=Upverter; ComponentLink4URL: https://datasheet.octopart.com/CC0805KRX7R9BB104-Yageo-datasheet-10883670.pdf; ComponentLink4Description: https://datasheet.octopart.com/CC0805KRX7R9BB104-Yageo-datasheet-10883670.pdf; ComponentLink5URL: https://datasheet.octopart.com:443/CC0805KRX7R9BB104-Yageo-datasheet-62336348.pdf?src-supplier=Newark; ComponentLink5Description: https://datasheet.octopart.com:443/CC0805KRX7R9BB104-Yageo-datasheet-62336348.pdf?src-supplier=Newark; ComponentLink6URL: https://datasheet.octopart.com:443/CC0805KRX7R9BB104-Yageo-datasheet-181969852.pdf?src-supplier=Newark; ComponentLink6Description: https://datasheet.octopart.com:443/CC0805KRX7R9BB104-Yageo-datasheet-181969852.pdf?src-supplier=Newark; ComponentLink7URL: https://datasheet.octopart.com:443/CC0805KRX7R9BB104-Yageo-datasheet-181969851.pdf?src-supplier=Newark; ComponentLink7Description: https://datasheet.octopart.com:443/CC0805KRX7R9BB104-Yageo-datasheet-181969851.pdf?src-supplier=Newark; ComponentLink8URL: https://datasheet.octopart.com:443/CC0805KRX7R9BB104-Phycomp-datasheet-499490.pdf?src-supplier=Newark; ComponentLink8Description: https://datasheet.octopart.com:443/CC0805KRX7R9BB104-Phycomp-datasheet-499490.pdf?src-supplier=Newark; ComponentLink9URL: https://datasheet.octopart.com:443/CC0805KRX7R9BB104-Yageo-datasheet-147453679.pdf?src-supplier=element14+APAC; ComponentLink9Description: https://datasheet.octopart.com:443/CC0805KRX7R9BB104-Yageo-datasheet-147453679.pdf?src-supplier=element14+APAC; ComponentLink10URL: https://datasheet.octopart.com:443/CC0805KRX7R9BB104-Yageo-datasheet-151948686.pdf?src-supplier=Farnell; ComponentLink10Description: https://datasheet.octopart.com:443/CC0805KRX7R9BB104-Yageo-datasheet-151948686.pdf?src-supplier=Farnell; ComponentLink11URL: https://datasheet.octopart.com:443/CC0805KRX7R9BB104-Yageo-Group-datasheet-188689702.pdf?src-supplier=Farnell; ComponentLink11Description: https://datasheet.octopart.com:443/CC0805KRX7R9BB104-Yageo-Group-datasheet-188689702.pdf?src-supplier=Farnell; ComponentLink12URL: https://datasheet.octopart.com:443/CC0805KRX7R9BB104-Phycomp-datasheet-500777.pdf?src-supplier=Farnell; ComponentLink12Description: https://datasheet.octopart.com:443/CC0805KRX7R9BB104-Phycomp-datasheet-500777.pdf?src-supplier=Farnell; ComponentLink13URL: https://datasheet.octopart.com:443/CC0805KRX7R9BB104-Yageo-Group-datasheet-189192896.pdf?src-supplier=Future+Electronics; ComponentLink13Description: https://datasheet.octopart.com:443/CC0805KRX7R9BB104-Yageo-Group-datasheet-189192896.pdf?src-supplier=Future+Electronics; ComponentLink14URL: https://datasheet.octopart.com:443/CC0805KRX7R9BB104-Yageo-datasheet-166511530.pdf?src-supplier=Future+Electronics; ComponentLink14Description: https://datasheet.octopart.com:443/CC0805KRX7R9BB104-Yageo-datasheet-166511530.pdf?src-supplier=Future+Electronics; ComponentLink15URL: https://datasheet.octopart.com:443/CC0805KRX7R9BB104-Yageo-datasheet-137700082.pdf?src-supplier=Future+Electronics; ComponentLink15Description: https://datasheet.octopart.com:443/CC0805KRX7R9BB104-Yageo-datasheet-137700082.pdf?src-supplier=Future+Electronics; ComponentLink16URL: https://datasheet.octopart.com:443/CC0805KRX7R9BB104-Yageo-datasheet-137700084.pdf?src-supplier=Future+Electronics; ComponentLink16Description: https://datasheet.octopart.com:443/CC0805KRX7R9BB104-Yageo-datasheet-137700084.pdf?src-supplier=Future+Electronics; ComponentLink17URL: https://datasheet.octopart.com:443/CC0805KRX7R9BB104-Yageo-datasheet-82288757.pdf?src-supplier=Future+Electronics; ComponentLink17Description: https://datasheet.octopart.com:443/CC0805KRX7R9BB104-Yageo-datasheet-82288757.pdf?src-supplier=Future+Electronics; ComponentLink18URL: https://datasheet.octopart.com:443/CC0805KRX7R9BB104-Yageo-datasheet-62139192.pdf?src-supplier=Future+Electronics; ComponentLink18Description: https://datasheet.octopart.com:443/CC0805KRX7R9BB104-Yageo-datasheet-62139192.pdf?src-supplier=Future+Electronics; ComponentLink19URL: https://datasheet.octopart.com:443/CC0805KRX7R9BB104-Yageo-datasheet-27626582.pdf?src-supplier=Future+Electronics; ComponentLink19Description: https://datasheet.octopart.com:443/CC0805KRX7R9BB104-Yageo-datasheet-27626582.pdf?src-supplier=Future+Electronics; ComponentLink20URL: https://datasheet.octopart.com:443/CC0805KRX7R9BB104-Yageo-datasheet-15895757.pdf?src-supplier=Future+Electronics; ComponentLink20Description: https://datasheet.octopart.com:443/CC0805KRX7R9BB104-Yageo-datasheet-15895757.pdf?src-supplier=Future+Electronics; ComponentLink21URL: https://datasheet.octopart.com:443/CC0805KRX7R9BB104-Yageo-datasheet-12526321.pdf?src-supplier=Future+Electronics; ComponentLink21Description: https://datasheet.octopart.com:443/CC0805KRX7R9BB104-Yageo-datasheet-12526321.pdf?src-supplier=Future+Electronics; ComponentLink22URL: https://datasheet.octopart.com:443/CC0805KRX7R9BB104-Yageo-datasheet-8324192.pdf?src-supplier=Future+Electronics; ComponentLink22Description: https://datasheet.octopart.com:443/CC0805KRX7R9BB104-Yageo-datasheet-8324192.pdf?src-supplier=Future+Electronics; ComponentLink23URL: https://datasheet.octopart.com:443/CC0805KRX7R9BB104-Yageo-Group-datasheet-184163374.pdf?src-supplier=LCSC; ComponentLink23Description: https://datasheet.octopart.com:443/CC0805KRX7R9BB104-Yageo-Group-datasheet-184163374.pdf?src-supplier=LCSC; ComponentLink24URL: https://datasheet.octopart.com:443/CC0805KRX7R9BB104-Yageo-Group-datasheet-165992755.pdf?src-supplier=ODG+(Origin+Data+Global); ComponentLink24Description: https://datasheet.octopart.com:443/CC0805KRX7R9BB104-Yageo-Group-datasheet-165992755.pdf?src-supplier=ODG+(Origin+Data+Global); ComponentLink25URL: https://datasheet.octopart.com:443/CC0805KRX7R9BB104-Yageo-datasheet-140260305.pdf?src-supplier=SOS+electronic; ComponentLink25Description: https://datasheet.octopart.com:443/CC0805KRX7R9BB104-Yageo-datasheet-140260305.pdf?src-supplier=SOS+electronic; ComponentLink26URL: https://datasheet.octopart.com:443/CC0805KRX7R9BB104-Yageo-datasheet-120101875.pdf?src-supplier=Megastar; ComponentLink26Description: https://datasheet.octopart.com:443/CC0805KRX7R9BB104-Yageo-datasheet-120101875.pdf?src-supplier=Megastar; ComponentLink27URL: https://datasheet.octopart.com:443/CC0805KRX7R9BB104-Yageo-datasheet-8701427.pdf?src-supplier=element14; ComponentLink27Description: https://datasheet.octopart.com:443/CC0805KRX7R9BB104-Yageo-datasheet-8701427.pdf?src-supplier=element14; ComponentLink28URL: https://datasheet.octopart.com:443/CC0805KRX7R9BB104-Yageo-datasheet-5301394.pdf?src-supplier=element14; ComponentLink28Description: https://datasheet.octopart.com:443/CC0805KRX7R9BB104-Yageo-datasheet-5301394.pdf?src-supplier=element14; ComponentLink29URL: https://datasheet.octopart.com:443/CC0805KRX7R9BB104-Yageo-datasheet-17600895.pdf?src-supplier=TME; ComponentLink29Description: https://datasheet.octopart.com:443/CC0805KRX7R9BB104-Yageo-datasheet-17600895.pdf?src-supplier=TME; ComponentLink30URL: https://datasheet.octopart.com:443/CC0805KRX7R9BB104-Yageo-datasheet-118396.pdf?src-supplier=DigiKey; ComponentLink30Description: https://datasheet.octopart.com:443/CC0805KRX7R9BB104-Yageo-datasheet-118396.pdf?src-supplier=DigiKey; ComponentLink31URL: http://sigma.octopart.com:80/conflict_mineral_statement/Yageo-company-3.pdf?src-supplier=Compliance+Statements; ComponentLink31Description: http://sigma.octopart.com:80/conflict_mineral_statement/Yageo-company-3.pdf?src-supplier=Compliance+Statements; ComponentLink32URL: http://sigma.octopart.com:80/rohs_statement/Yageo-company-2.pdf?src-supplier=Compliance+Statements; ComponentLink32Description: http://sigma.octopart.com:80/rohs_statement/Yageo-company-2.pdf?src-supplier=Compliance+Statements
C?#4 = TMK212BBJ106KG-T: CAP CER 10uF 25V X5R 0805; Manufacturer: TAIYO YUDEN; Manufacturer Package Identifier: 0805 (2012 metric); Value: 10µF; Dielectric Material: Ceramic; Tolerance: 10%; Voltage: 16V; Supplier: Future Electronics; Supplier Part Number: TMK212BBJ106KG-T; Manufacturer Part Number: TMK212BBJ106KG-T; RoHS: Compliant; Category: Ceramic Capacitors; Stock: 405000; Pricing: 3000=0.158, 6000=0.156, 9000=0.154, 12000=0.153 (USD); Case/Package: 0805; Case Code (Imperial): 0805; Case Code (Metric): 2012; Composition: Ceramic; Country of Origin: Japan, Mainland China, Malaysia, South Korea; Dielectric: X5R; Export Control Classification Number (ECCN) Code: EAR99; Height: 1.25mm; Harmonized Tariff Schedule (HTS) Code: 8532.24.00.20; Introduction Date: 2012-09-27; Lead Free: Lead Free; Length: 2mm; Lifecycle Status: Production; Material: Ceramic; Max Operating Temperature: 85°C; Min Operating Temperature: -55°C; Mounting Technology: Surface Mount; Pins: 2; Number of Terminals: 2; REACH SVHC: Unaffected; Termination: SMD/SMT; Thickness: 1.3462mm; Voltage Rating: 25V; Voltage Rating (DC): 25V; Width: 1.25mm; ComponentLink1URL: https://datasheet.octopart.com:443/TMK212BBJ106KG-T-Taiyo-Yuden-datasheet-182120866.pdf?src-supplier=IHS; ComponentLink1Description: https://datasheet.octopart.com:443/TMK212BBJ106KG-T-Taiyo-Yuden-datasheet-182120866.pdf?src-supplier=IHS; ComponentLink2URL: https://datasheet.octopart.com:443/TMK212BBJ106KG-T-Taiyo-Yuden-datasheet-181961944.pdf?src-supplier=Newark; ComponentLink2Description: https://datasheet.octopart.com:443/TMK212BBJ106KG-T-Taiyo-Yuden-datasheet-181961944.pdf?src-supplier=Newark; ComponentLink3URL: https://datasheet.octopart.com:443/TMK212BBJ106KG-T-Taiyo-Yuden-datasheet-23715841.pdf?src-supplier=Newark; ComponentLink3Description: https://datasheet.octopart.com:443/TMK212BBJ106KG-T-Taiyo-Yuden-datasheet-23715841.pdf?src-supplier=Newark; ComponentLink4URL: https://datasheet.octopart.com:443/TMK212BBJ106KG-T-Taiyo-Yuden-datasheet-10851928.pdf?src-supplier=element14+APAC; ComponentLink4Description: https://datasheet.octopart.com:443/TMK212BBJ106KG-T-Taiyo-Yuden-datasheet-10851928.pdf?src-supplier=element14+APAC; ComponentLink5URL: https://datasheet.octopart.com:443/TMK212BBJ106KG-T-Taiyo-Yuden-datasheet-154810078.pdf?src-supplier=Master+Electronics; ComponentLink5Description: https://datasheet.octopart.com:443/TMK212BBJ106KG-T-Taiyo-Yuden-datasheet-154810078.pdf?src-supplier=Master+Electronics; ComponentLink6URL: https://datasheet.octopart.com:443/TMK212BBJ106KG-T-Taiyo-Yuden-datasheet-10742123.pdf?src-supplier=Future+Electronics; ComponentLink6Description: https://datasheet.octopart.com:443/TMK212BBJ106KG-T-Taiyo-Yuden-datasheet-10742123.pdf?src-supplier=Future+Electronics; ComponentLink7URL: https://datasheet.octopart.com:443/TMK212BBJ106KG-T-Taiyo-Yuden-datasheet-99833418.pdf?src-supplier=Future+Electronics; ComponentLink7Description: https://datasheet.octopart.com:443/TMK212BBJ106KG-T-Taiyo-Yuden-datasheet-99833418.pdf?src-supplier=Future+Electronics; ComponentLink8URL: https://datasheet.octopart.com:443/TMK212BBJ106KG-T-Taiyo-Yuden-datasheet-138738940.pdf?src-supplier=Taiyo+Yuden+SCT; ComponentLink8Description: https://datasheet.octopart.com:443/TMK212BBJ106KG-T-Taiyo-Yuden-datasheet-138738940.pdf?src-supplier=Taiyo+Yuden+SCT; ComponentLink9URL: https://datasheet.octopart.com:443/TMK212BBJ106KG-T-Taiyo-Yuden-datasheet-27089299.pdf?src-supplier=Electro+Sonic; ComponentLink9Description: https://datasheet.octopart.com:443/TMK212BBJ106KG-T-Taiyo-Yuden-datasheet-27089299.pdf?src-supplier=Electro+Sonic